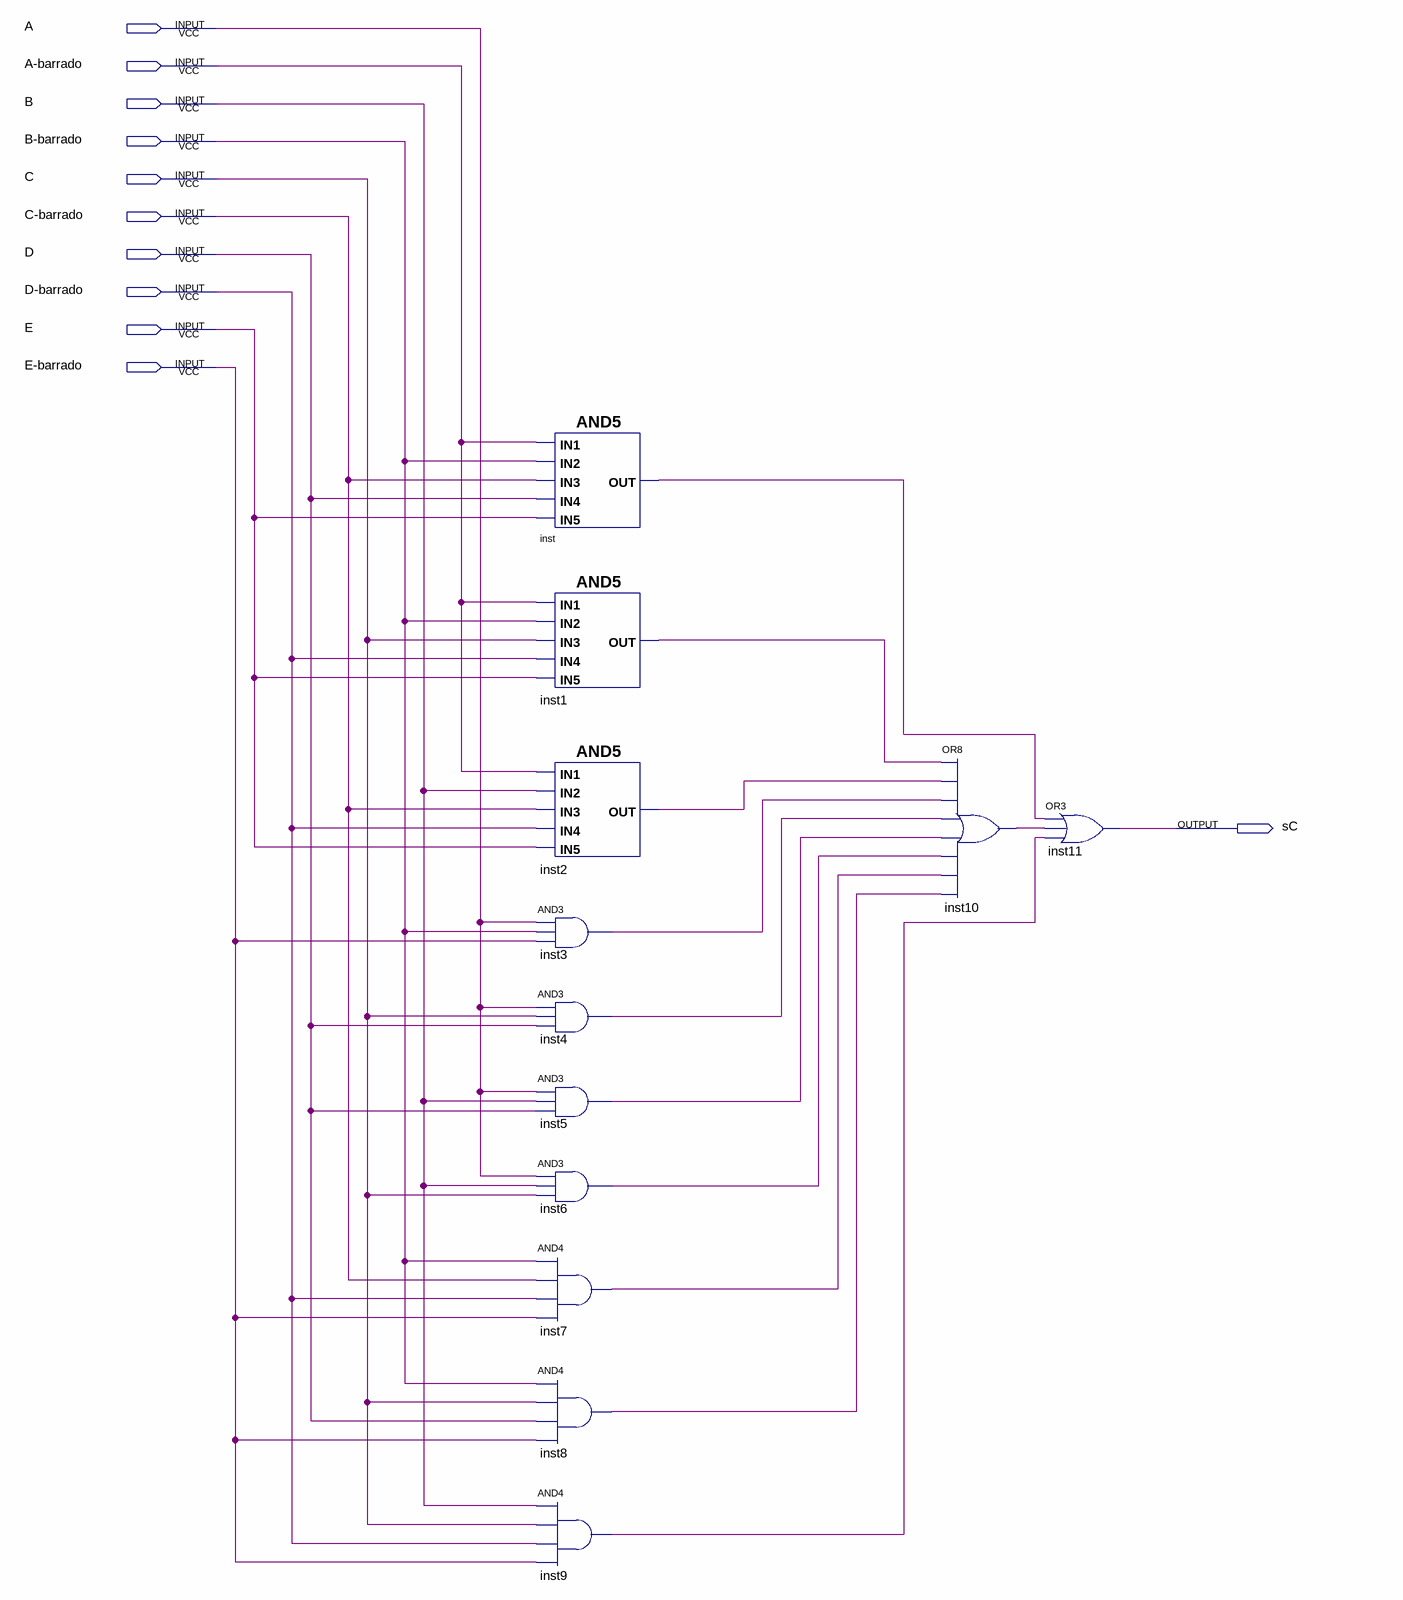
[diagram p0: schematic sheet]
// Quartus schematic saida_C.bdf as structural Verilog: 12 symbols, 11 pins
module saida_C (
  input  A,
  input  \A-barrado ,
  input  B,
  input  \B-barrado ,
  input  C,
  input  \C-barrado ,
  input  D,
  input  \D-barrado ,
  input  E,
  input  \E-barrado ,
  output sC
);

  wire inst1_out, inst2_out, inst3_out, inst4_out, inst5_out, inst6_out, inst7_out, inst8_out, inst9_out,
       inst10_out, inst_out;

  and inst (inst_out, \A-barrado , \B-barrado , \C-barrado , D, E);
  and inst1 (inst1_out, \A-barrado , \B-barrado , C, \D-barrado , E);
  and inst2 (inst2_out, \A-barrado , B, \C-barrado , \D-barrado , E);
  and inst3 (inst3_out, A, \B-barrado , \E-barrado );
  and inst4 (inst4_out, A, C, D);
  and inst5 (inst5_out, A, B, D);
  and inst6 (inst6_out, A, B, C);
  and inst7 (inst7_out, \B-barrado , \C-barrado , \D-barrado , \E-barrado );
  and inst8 (inst8_out, \B-barrado , C, D, \E-barrado );
  and inst9 (inst9_out, B, C, \D-barrado , \E-barrado );
  or inst10 (inst10_out, inst1_out, inst2_out, inst3_out, inst4_out, inst5_out, inst6_out, inst7_out, inst8_out);
  or inst11 (sC, inst_out, inst10_out, inst9_out);
endmodule
